# EAGLE schematic p8x-cf-card (EAGLE 9.6.2)
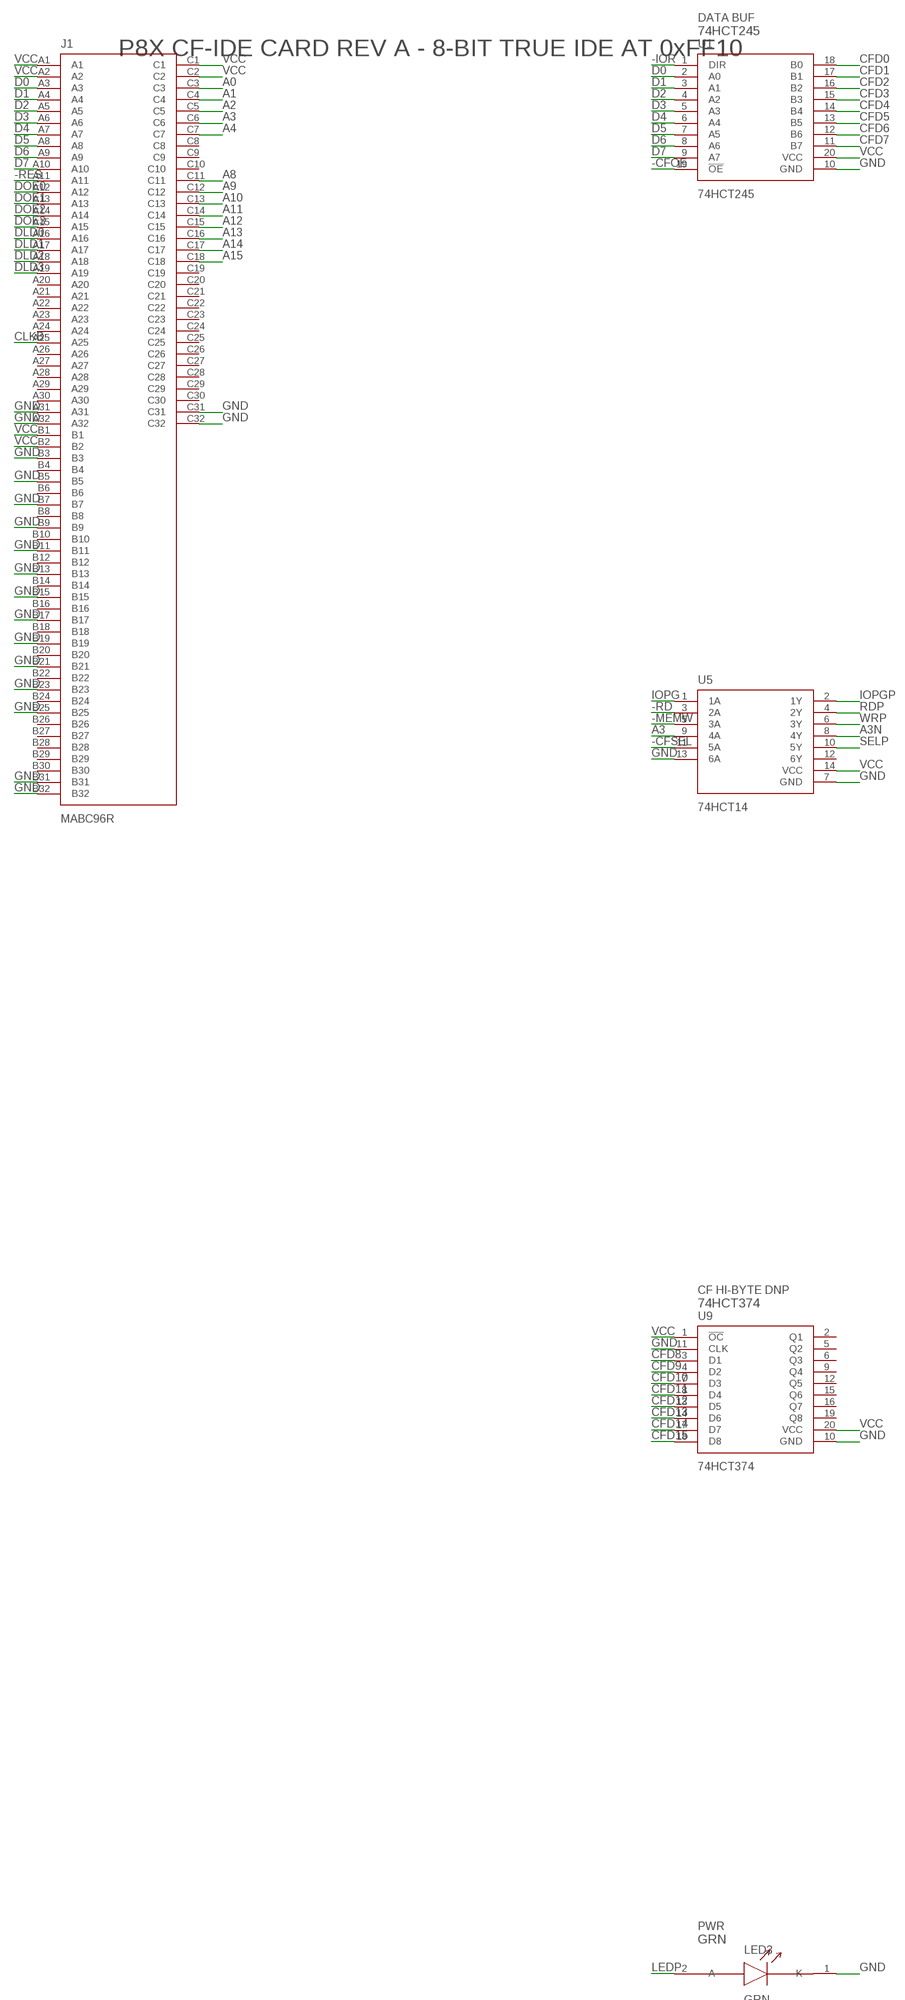
[diagram p0: schematic, sheet 1, part 1 of 3]
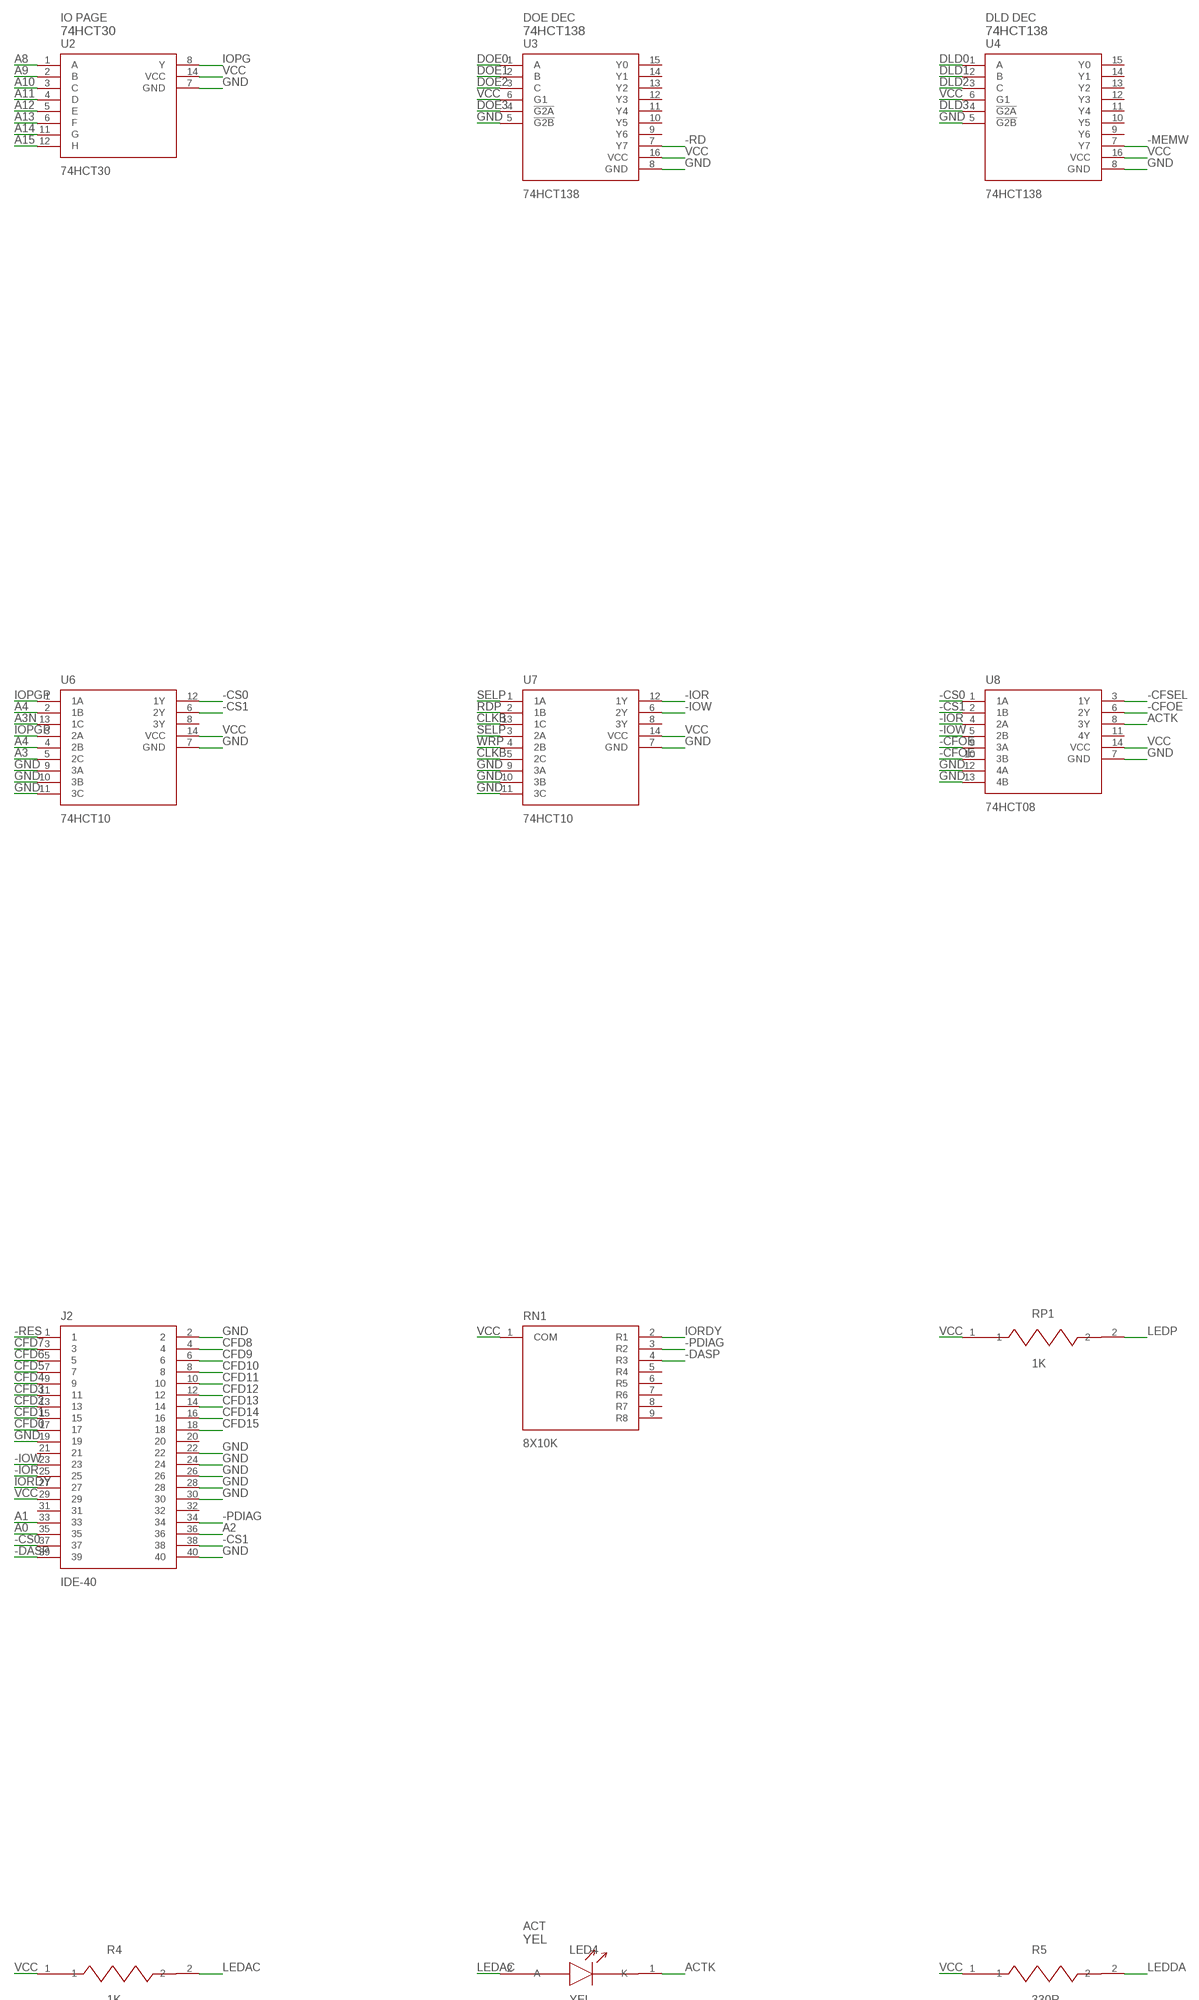
[diagram p1: schematic, sheet 1, part 2 of 3]
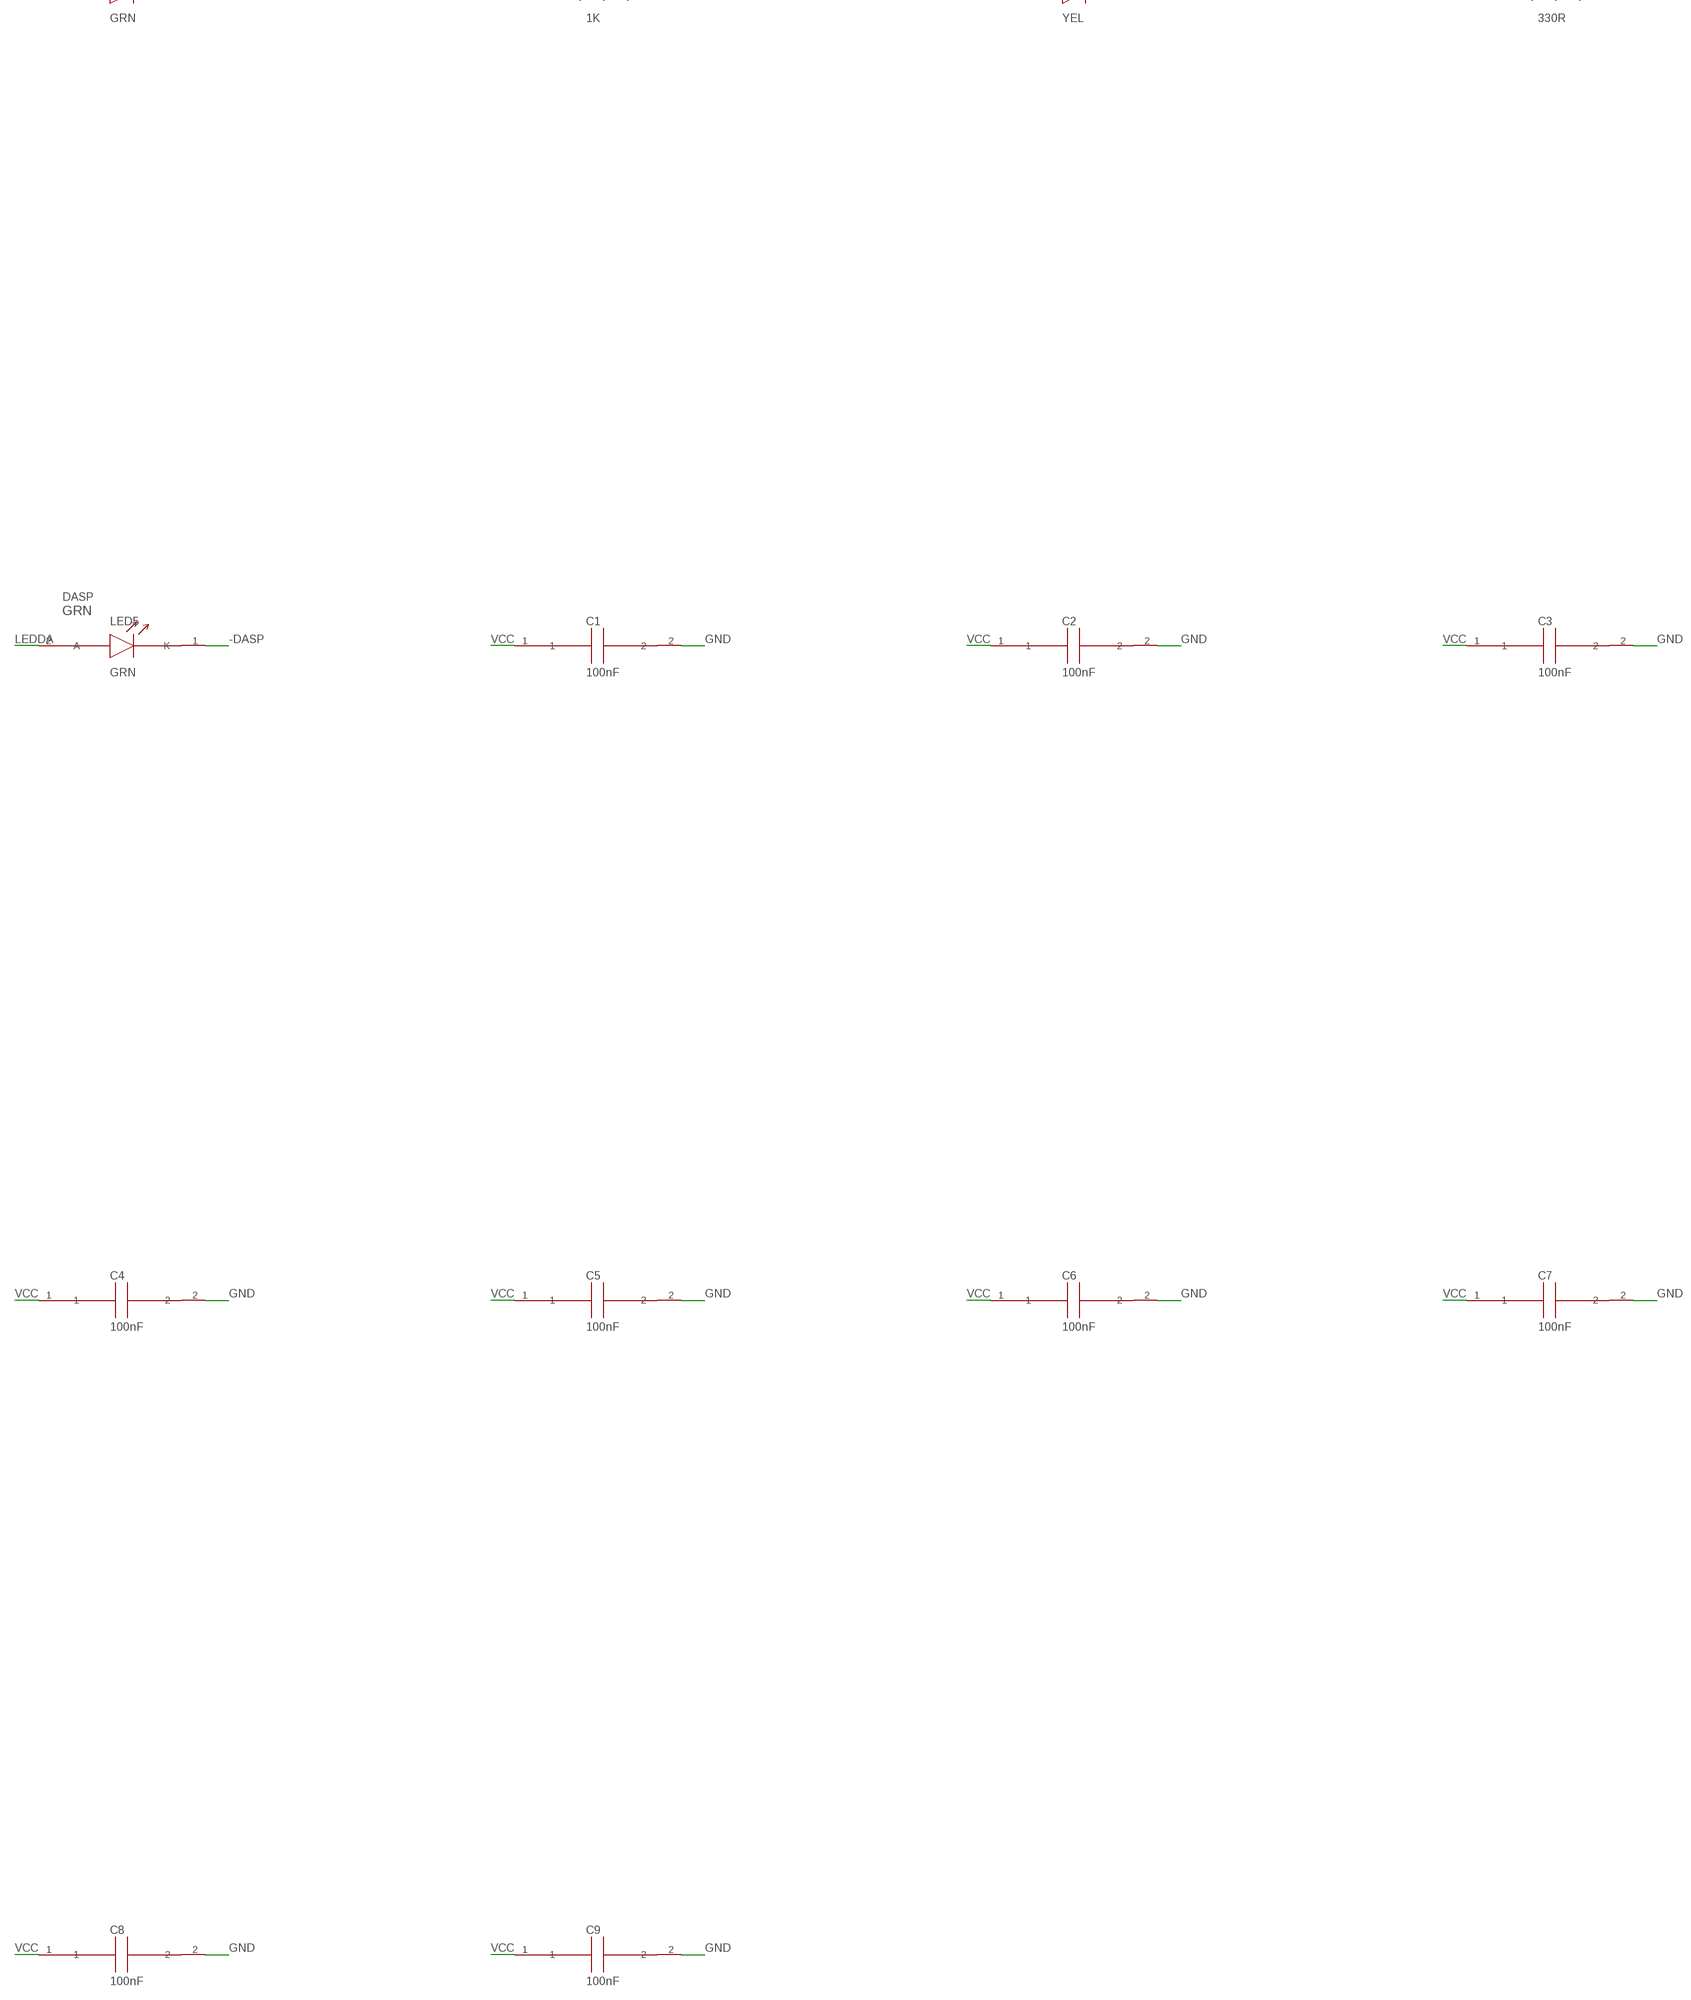
[diagram p2: schematic, sheet 1, part 3 of 3]

## Parts
C1  100nF  CAP1  [C_DISC1]
C2  100nF  CAP1  [C_DISC1]
C3  100nF  CAP1  [C_DISC1]
C4  100nF  CAP1  [C_DISC1]
C5  100nF  CAP1  [C_DISC1]
C6  100nF  CAP1  [C_DISC1]
C7  100nF  CAP1  [C_DISC1]
C8  100nF  CAP1  [C_DISC1]
C9  100nF  CAP1  [C_DISC1]
J1  MABC96R  DIN96C  [MABC96R]
J2  IDE-40  IDE40  [HDR40]
LED3  GRN  LED  [LED5]
LED4  YEL  LED  [LED5]
LED5  GRN  LED  [LED5]
R4  1K  RES  [R_AXIAL]
R5  330R  RES  [R_AXIAL]
RN1  8X10K  SIP9  [SIP9]
RP1  1K  RES  [R_AXIAL]
U1  74HCT245  74245  [DIP20]
U2  74HCT30  7430  [DIP14]
U3  74HCT138  74138  [DIP16]
U4  74HCT138  74138  [DIP16]
U5  74HCT14  HEX14  [DIP14]
U6  74HCT10  7410  [DIP14]
U7  74HCT10  7410  [DIP14]
U8  74HCT08  GATES14  [DIP14]
U9  74HCT374  74374  [DIP20]

## Nets
-CFOE: U1.19(!OE) U8.6(2Y) U8.9(3A) U8.10(3B)
-CFSEL: U5.11(5A) U8.3(1Y)
-CS0: J2.37 U6.12(1Y) U8.1(1A)
-CS1: J2.38 U6.6(2Y) U8.2(1B)
-DASP: J2.39 LED5.1(K) RN1.4(R3)
-IOR: J2.25 U1.1(DIR) U7.12(1Y) U8.4(2A)
-IOW: J2.23 U7.6(2Y) U8.5(2B)
-MEMW: U4.7(Y7) U5.5(3A)
-PDIAG: J2.34 RN1.3(R2)
-RD: U3.7(Y7) U5.3(2A)
-RES: J1.A11 J2.1
A0: J1.C3 J2.35
A1: J1.C4 J2.33
A2: J1.C5 J2.36
A3: J1.C6 U5.9(4A) U6.5(2C)
A3N: U5.8(4Y) U6.13(1C)
A4: J1.C7 U6.2(1B) U6.4(2B)
A8: J1.C11 U2.1(A)
A9: J1.C12 U2.2(B)
A10: J1.C13 U2.3(C)
A11: J1.C14 U2.4(D)
A12: J1.C15 U2.5(E)
A13: J1.C16 U2.6(F)
A14: J1.C17 U2.11(G)
A15: J1.C18 U2.12(H)
ACTK: LED4.1(K) U8.8(3Y)
CFD0: J2.17 U1.18(B0)
CFD1: J2.15 U1.17(B1)
CFD2: J2.13 U1.16(B2)
CFD3: J2.11 U1.15(B3)
CFD4: J2.9 U1.14(B4)
CFD5: J2.7 U1.13(B5)
CFD6: J2.5 U1.12(B6)
CFD7: J2.3 U1.11(B7)
CFD8: J2.4 U9.3(D1)
CFD9: J2.6 U9.4(D2)
CFD10: J2.8 U9.7(D3)
CFD11: J2.10 U9.8(D4)
CFD12: J2.12 U9.13(D5)
CFD13: J2.14 U9.14(D6)
CFD14: J2.16 U9.17(D7)
CFD15: J2.18 U9.18(D8)
CLKB: J1.A25 U7.5(2C) U7.13(1C)
D0: J1.A3 U1.2(A0)
D1: J1.A4 U1.3(A1)
D2: J1.A5 U1.4(A2)
D3: J1.A6 U1.5(A3)
D4: J1.A7 U1.6(A4)
D5: J1.A8 U1.7(A5)
D6: J1.A9 U1.8(A6)
D7: J1.A10 U1.9(A7)
DLD0: J1.A16 U4.1(A)
DLD1: J1.A17 U4.2(B)
DLD2: J1.A18 U4.3(C)
DLD3: J1.A19 U4.4(!G2A)
DOE0: J1.A12 U3.1(A)
DOE1: J1.A13 U3.2(B)
DOE2: J1.A14 U3.3(C)
DOE3: J1.A15 U3.4(!G2A)
GND: C1.2 C2.2 C3.2 C4.2 C5.2 C6.2 C7.2 C8.2 C9.2 J1.A31 J1.A32 J1.B3 J1.B5 J1.B7 J1.B9 J1.B11 J1.B13 J1.B15 J1.B17 J1.B19 J1.B21 J1.B23 J1.B25 J1.B31 J1.B32 J1.C31 J1.C32 J2.2 J2.19 J2.22 J2.24 J2.26 J2.28 J2.30 J2.40 LED3.1(K) U1.10(GND) U2.7(GND) U3.5(!G2B) U3.8(GND) U4.5(!G2B) U4.8(GND) U5.7(GND) U5.13(6A) U6.7(GND) U6.9(3A) U6.10(3B) U6.11(3C) U7.7(GND) U7.9(3A) U7.10(3B) U7.11(3C) U8.7(GND) U8.12(4A) U8.13(4B) U9.10(GND) U9.11(CLK)
IOPG: U2.8(Y) U5.1(1A)
IOPGP: U5.2(1Y) U6.1(1A) U6.3(2A)
IORDY: J2.27 RN1.2(R1)
LEDAC: LED4.2(A) R4.2
LEDDA: LED5.2(A) R5.2
LEDP: LED3.2(A) RP1.2
RDP: U5.4(2Y) U7.2(1B)
SELP: U5.10(5Y) U7.1(1A) U7.3(2A)
VCC: C1.1 C2.1 C3.1 C4.1 C5.1 C6.1 C7.1 C8.1 C9.1 J1.A1 J1.A2 J1.B1 J1.B2 J1.C1 J1.C2 J2.29 R4.1 R5.1 RN1.1(COM) RP1.1 U1.20(VCC) U2.14(VCC) U3.6(G1) U3.16(VCC) U4.6(G1) U4.16(VCC) U5.14(VCC) U6.14(VCC) U7.14(VCC) U8.14(VCC) U9.1(!OC) U9.20(VCC)
WRP: U5.6(3Y) U7.4(2B)
Unconnected: J1.A20 J1.A21 J1.A22 J1.A23 J1.A24 J1.A26 J1.A27 J1.A28 J1.A29 J1.A30 J1.B4 J1.B6 J1.B8 J1.B10 J1.B12 J1.B14 J1.B16 J1.B18 J1.B20 J1.B22 J1.B24 J1.B26 J1.B27 J1.B28 J1.B29 J1.B30 J1.C8 J1.C9 J1.C10 J1.C19 J1.C20 J1.C21 J1.C22 J1.C23 J1.C24 J1.C25 J1.C26 J1.C27 J1.C28 J1.C29 J1.C30 J2.20 J2.21 J2.31 J2.32 RN1.5(R4) RN1.6(R5) RN1.7(R6) RN1.8(R7) RN1.9(R8) U3.9(Y6) U3.10(Y5) U3.11(Y4) U3.12(Y3) U3.13(Y2) U3.14(Y1) U3.15(Y0) U4.9(Y6) U4.10(Y5) U4.11(Y4) U4.12(Y3) U4.13(Y2) U4.14(Y1) U4.15(Y0) U5.12(6Y) U6.8(3Y) U7.8(3Y) U8.11(4Y) U9.2(Q1) U9.5(Q2) U9.6(Q3) U9.9(Q4) U9.12(Q5) U9.15(Q6) U9.16(Q7) U9.19(Q8)

## Notes on the sheet
- DATA BUF | IO PAGE | DOE DEC | DLD DEC
- 74HCT245 | 74HCT30 | 74HCT138 | 74HCT138
- P8X CF-IDE CARD REV A - 8-BIT TRUE IDE AT 0xFF10
- CF HI-BYTE DNP
- 74HCT374
- PWR | ACT
- GRN | YEL
- DASP
- GRN

## Library data of the parts
C1-C9 = p8x:CAP1
J1 = p8x:DIN96C
J2 = p8x:IDE40
LED3-LED5 = p8x:LED
R4 R5 RP1 = p8x:RES
RN1 = p8x:SIP9
U1 = p8x:74245
U2 = p8x:7430
U3 U4 = p8x:74138
U5 = p8x:HEX14
U6 U7 = p8x:7410
U8 = p8x:GATES14
U9 = p8x:74374